# Altium schematic sheet ft4232h.SchDoc: Test
size A4; DrawnBy: Łukasz Przeniosło; Organization: Zachodniopomorski; Address1: Uniwersytet Technologiczny; Address2: w Szczecinie; Address3: Wydział Elektryczny; DocumentNumber: 4; Revision: 1.0; SheetNumber: 4; SheetTotal: 8
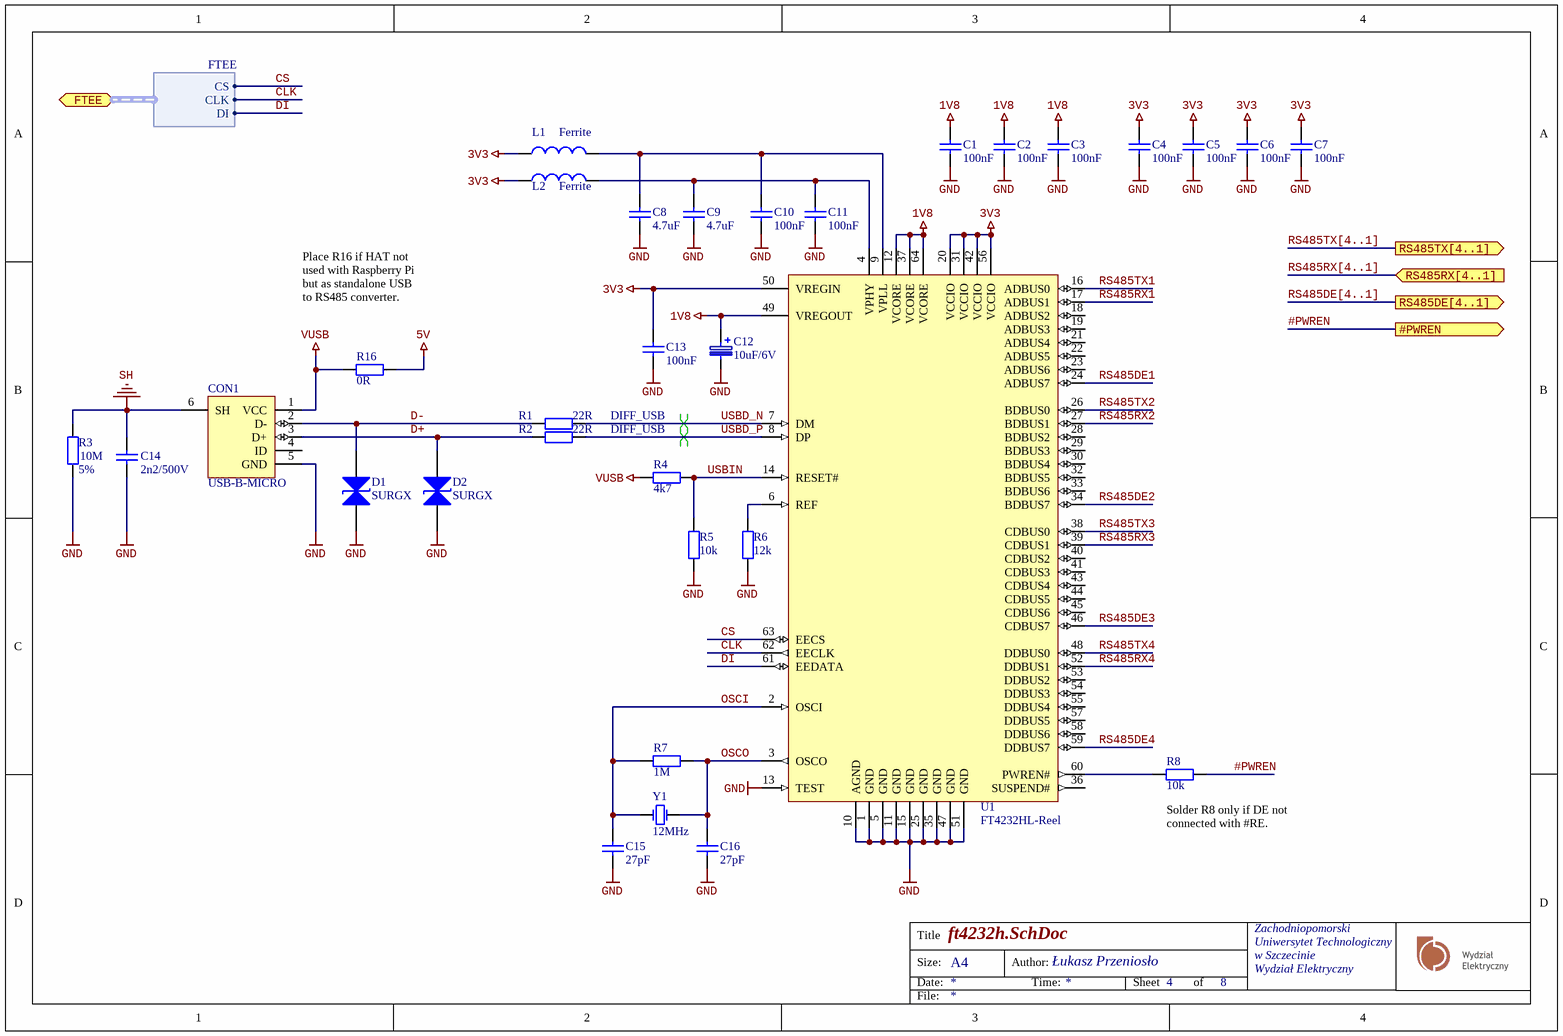
[diagram p0: ft4232h.SchDoc]

## Parts
C1  100nF  [CAPC1608N]
C2  100nF  [CAPC1608N]
C3  100nF  [CAPC1608N]
C4  100nF  [CAPC1608N]
C5  100nF  [CAPC1608N]
C6  100nF  [CAPC1608N]
C7  100nF  [CAPC1608N]
C8  4.7uF  [CAPC1608N]
C9  4.7uF  [CAPC1608N]
C10  100nF  [CAPC1608N]
C11  100nF  [CAPC1608N]
C12  10uF/6V  [SMDA]
C13  100nF  [CAPC1608N]
C14  2n2/500V  [CAPC3216N]
C15  27pF  [CAPC1608N]
C16  27pF  [CAPC1608N]
CON1  USB-B-MICRO  [MICRO-USB-CONNECTOR]
D1  SURGX  [SURGX-0603]
D2  SURGX  [SURGX-0603]
L1  Ferrite  [inductor_0603]
L2  Ferrite  [inductor_0603]
R1  22R  [RESC1608N]
R2  22R  [RESC1608N]
R3  Tolerance: 5%  [RESC3216N]  (hidden comment: 10M)
R4  4k7  [RESC1608N]
R5  10k  [RESC1608N]
R6  12k  [RESC1608N]
R7  1M  [RESC1608N]
R8  10k  [RESC1608N]
R16  0R  [RESC2012N]
U1  FT4232HL-Reel  [LQFP-64_L]
Y1  12MHz  [HC49/4H_SMX]

## Ports
#PWREN (out), FTEE (harness FTEE), RS485DE[4..1] (out), RS485RX[4..1] (in), RS485TX[4..1] (out)

## Harnesses
FTEE: CS, CLK, DI

## Nets
1V8: C1.1 C2.1 C3.1 C12.1 U1.12(VCORE) U1.37(VCORE) U1.49(VREGOUT) U1.64(VCORE)
3V3: C4.1 C5.1 C6.1 C7.1 C13.1 L1.1 L2.1 U1.20(VCCIO) U1.31(VCCIO) U1.42(VCCIO) U1.50(VREGIN) U1.56(VCCIO)
5V: R16.1
GND: C1.2 C2.2 C3.2 C4.2 C5.2 C6.2 C7.2 C8.2 C9.2 C10.2 C11.2 C12.2 C13.2 C14.1 C15.1 C16.1 CON1.5(GND) D1.1 D2.1 R3.1 R5.2 R6.2 U1.1(GND) U1.5(GND) U1.10(AGND) U1.11(GND) U1.13(TEST) U1.15(GND) U1.25(GND) U1.35(GND) U1.47(GND) U1.51(GND)
SH: C14.2 CON1.6(SH) R3.2
VUSB: CON1.1(VCC) R4.1 R16.2
#PWREN: R8.1 ; port #PWREN
CLK: U1.62(EECLK) ; port FTEE.CLK
CS: U1.63(EECS) ; port FTEE.CS
D+: CON1.3(D+) D2.2 R2.1
D-: CON1.2(D-) D1.2 R1.1
DI: U1.61(EEDATA) ; port FTEE.DI
OSCI: C15.2 R7.2 U1.2(OSCI) Y1.1(OSC1)
OSCO: C16.2 R7.1 U1.3(OSCO) Y1.2(OSC2)
RS485DE1: U1.24(ADBUS7)
RS485DE2: U1.34(BDBUS7)
RS485DE3: U1.46(CDBUS7)
RS485DE4: U1.59(DDBUS7)
RS485RX1: U1.17(ADBUS1)
RS485RX2: U1.27(BDBUS1)
RS485RX3: U1.39(CDBUS1)
RS485RX4: U1.52(DDBUS1)
RS485TX1: U1.16(ADBUS0)
RS485TX2: U1.26(BDBUS0)
RS485TX3: U1.38(CDBUS0)
RS485TX4: U1.48(DDBUS0)
USBD_N: R1.2 U1.7(DM)
USBD_P: R2.2 U1.8(DP)
USBIN: R4.2 R5.1 U1.14(RESET#)
NetC8_1: C8.1 C10.1 L1.2 U1.9(VPLL)
NetC9_1: C9.1 C11.1 L2.2 U1.4(VPHY)
NetR6_1: R6.1 U1.6(REF)
NetR8_2: R8.2 U1.60(PWREN#)

Not connected (* = marked no-connect by the designer): CON1 4(ID); U1 18(ADBUS2) 19(ADBUS3) 21(ADBUS4) 22(ADBUS5) 23(ADBUS6) 28(BDBUS2) 29(BDBUS3) 30(BDBUS4) 32(BDBUS5) 33(BDBUS6) 36(SUSPEND#) 40(CDBUS2) 41(CDBUS3) 43(CDBUS4) 44(CDBUS5) 45(CDBUS6) 53(DDBUS2) 54(DDBUS3) 55(DDBUS4) 57(DDBUS5) 58(DDBUS6)

## Buses and harness runs
bus RS485DE[4..1] = port RS485DE[4..1]
bus RS485RX[4..1] = port RS485RX[4..1]
bus RS485TX[4..1] = port RS485TX[4..1]

## Layout directives
differential pair; net class DIFF_USB: USBD_N, USBD_P

## Notes on the sheet
- Place R16 if HAT not used with Raspberry Pi but as standalone USB to RS485 converter.
- (near R8) Solder R8 only if DE not connected with #RE.
- Title
- Size:
- Date:
- A4
- Author:
- Time:
- Sheet
- of
- File:

## Library data of the parts
C1-C11 C13-C16 = Capacitor
  C1-C7 C10 C11 C13: Value: 100nF
  C8 C9: Value: 4.7uF
  C14: Value: 2n2/500V
  C15 C16: Value: 27pF
C12 = 100uF 6.3V-SMDB: Polarized Capacitor (Surface Mount); Value: 10uF; PackageReference: SMDB; Manufacturer: *; Manufacturer Part No.: *; Distributor: tme.pl; Distributor Order Code: TC 100/6.3-SMDB; tme.pl: TC 100/6.3-SMDA; farnell: 1135048
CON1 = USB-B-MICRO-Sock
D1 D2 = SURGX: ESD Suppressor; ComponentLink1Description: Manufacturer Link; ComponentLink2Description: Datasheet; Distributor: tme.pl
L1 L2 = Inductor: Code_IEC: 1005; Value: 10mH; Published: 8-Jun-2000; LatestRevisionDate: 29-May-2009; LatestRevisionNote: IPC-7351 Footprint Added.; PackageReference: 0402-A; Publisher: Altium Limited; PackageDescription: Chip Inductor; Code_JEITA: 0402
R1 R2 R16 = Resistor: Tolerance: 5%; Power: 0W
  R1 R2: Value: 22R
  R16: Value: 0R
R3 = Resistor: Power: 0W; Value: 10M
R4-R6 = Resistor: Tolerance: 1%; Power: 0W
  R4: Value: 4k7
  R5: Value: 10k
  R6: Value: 12k
R7 R8 = Resistor: Power: 0W; Tolerance: 5%
  R7: Value: 1M
  R8: Value: 10k
U1 = COM-UART-FT4232H-LQFP64: Quad High Speed USB To Multipurpose UART/MPSSE IC, 64-pin LQFP, Tape and Reel; Manufacturer: FTDI; PackageDescription: 64-Pin Thin Quad Flat Pack, 10 x 10 x 1.4 mm Body, 0.5 mm Pitch; DatasheetVersion: ver 2.2, Jan-2012; ComponentLink2URL: http://www.ftdichip.com/Support/Documents/DataSheets/ICs/DS_FT4232H.pdf; ComponentLink1Description: Manufacturer URL; PackageReference: LQFP-64; PackageVersion: Jan-12; RevisionNote: DatasheetVersion updated to 2.2 Jan-2012; PartNumber: FT4232HL-Reel; ComponentLink1URL: http://www.ftdichip.com/; ComponentLink2Description: Datasheet
Y1 = HC49: Value: 12MHz